# EAGLE design tick-ref-gps-main (EAGLE 6.2)
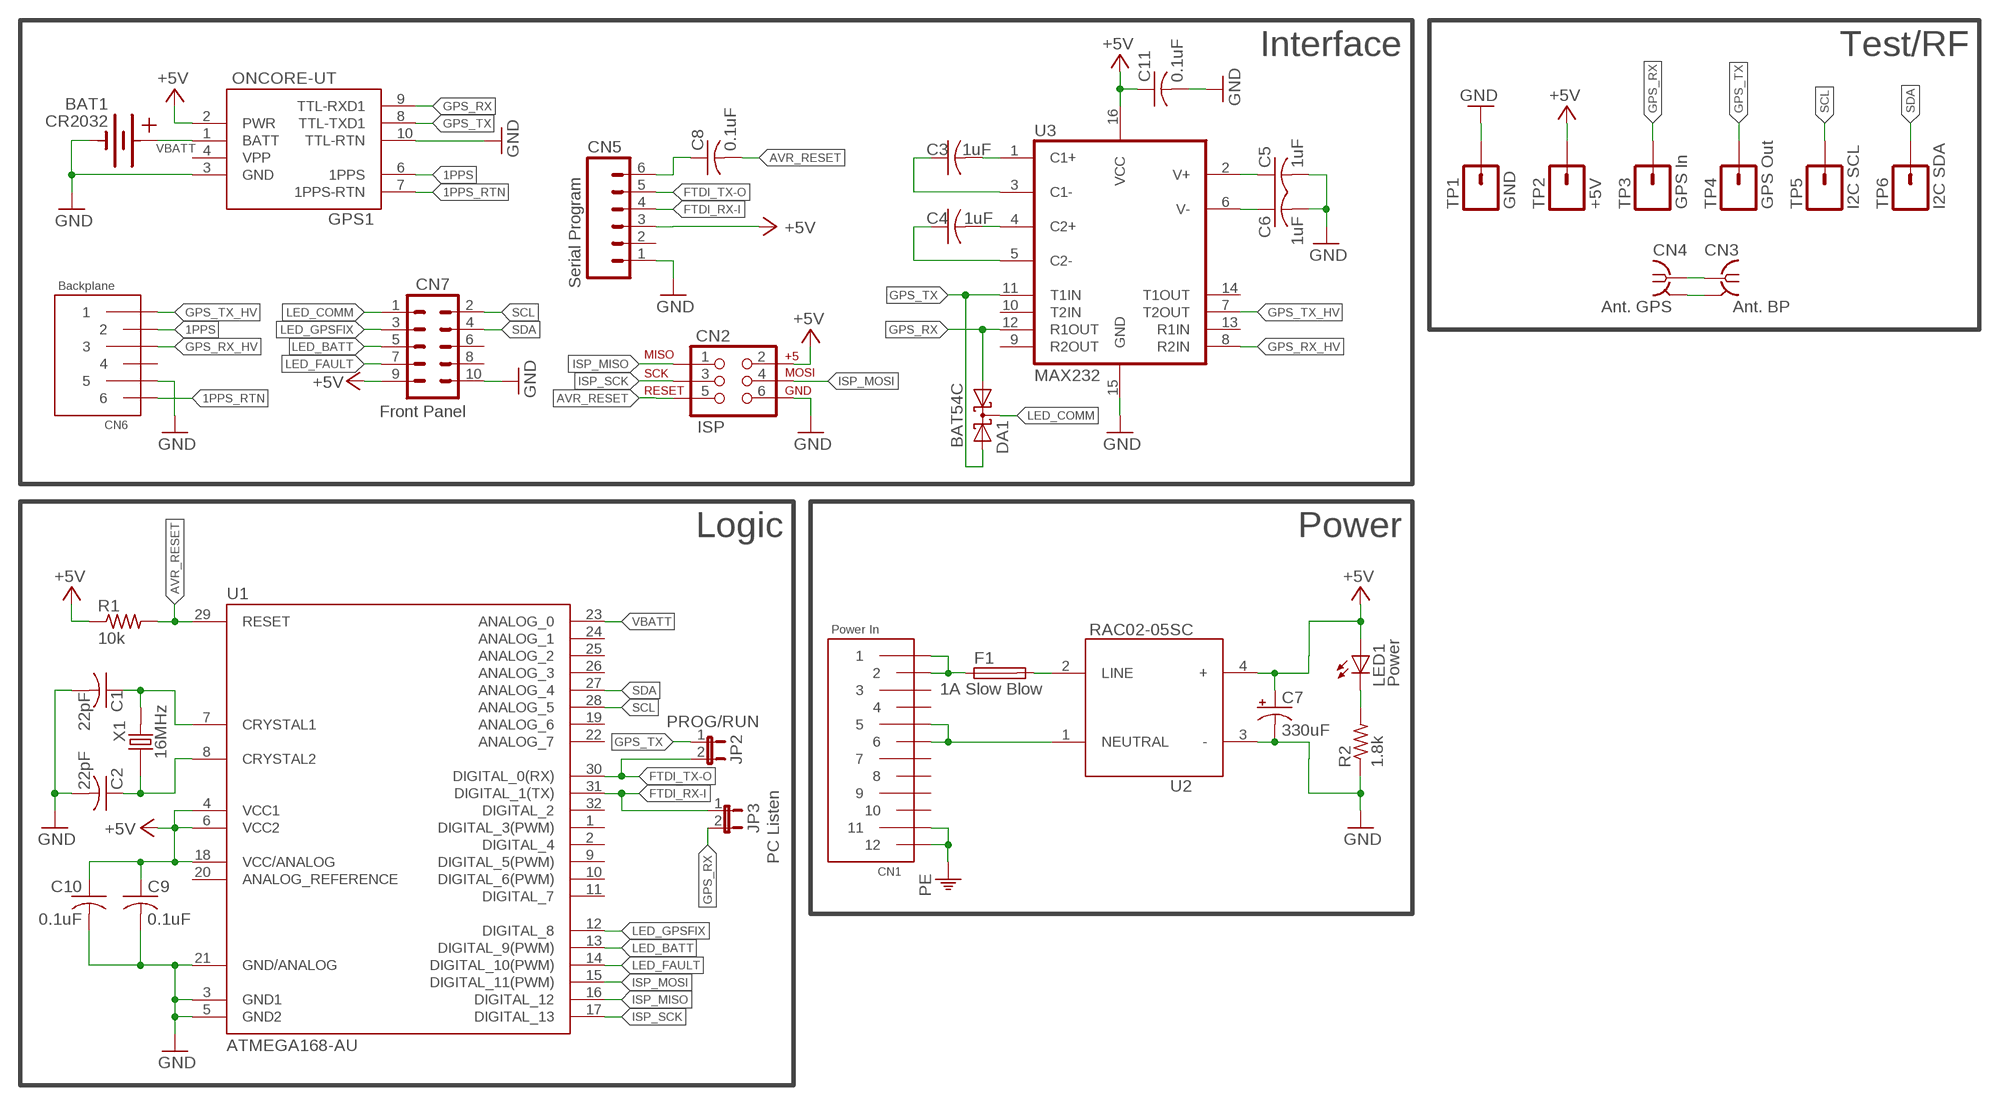
[diagram p0: schematic, sheet 1]

## Parts
BAT1  CR2032  [BK-912-CR2032]
C1  22pF  C-USC0603  [C0603]
C2  22pF  C-USC0603  [C0603]
C3  1uF  C-USC0603  [C0603]
C4  1uF  C-USC0603  [C0603]
C5  1uF  C-USC0603  [C0603]
C6  1uF  C-USC0603  [C0603]
C7  330uF  CPOL-USE5-10.5  [E5-10,5]
C8  0.1uF  C-USC0603  [C0603]
C9  0.1uF  C-USC0603  [C0603]
C10  0.1uF  C-USC0603  [C0603]
C11  0.1uF  C-USC0603  [C0603]
CN1  Power In  EDGECON-M-0.15-12  [EDGECON-M-0.15-12]
CN2  ISP  AVR_SPI_PRG_62X3_LOCK  [2X3_LOCK]
CN3  Ant. BP  COAX  [MMCX-J-P-X-ST-EM1-MKT]
CN4  Ant. GPS  MOLEX-MCX-V  [MOLEX-MCX-V]
CN5  Serial Program  M06LOCK  [1X06_LOCK]
CN6  Backplane  EDGECON-M-0.1-6  [EDGECON-M-0.1-6]
CN7  Front Panel  M05X2PTH  [AVR_ICSP]
DA1  BAT54C  [SOT23]
F1  1A Slow Blow  SH22,5A  [SH22,5A]
GPS1  ONCORE-UT  [ONCORE-UT]
JP2  PROG/RUN  JUMPER-2PTH_LOCK  [1X02_LOCK]
JP3  PC Listen  JUMPER-2SMD-NO  [SJ_2S-NO]
LED1  Power  LEDCHIP-LED0603  [CHIP-LED0603]
R1  10k  R-US_R0603  [R0603]
R2  1.8k  R-US_R0603  [R0603]
TP1  GND  M01PTH  [1X01]
TP2  +5V  M01PTH  [1X01]
TP3  GPS In  M01PTH  [1X01]
TP4  GPS Out  M01PTH  [1X01]
TP5  I2C SCL  M01PTH  [1X01]
TP6  I2C SDA  M01PTH  [1X01]
U1  ATMEGA168-AU  [TQFP32-08]
U2  RAC02-05SC  RAC0X-SC  [RAC0X-SC]
U3  MAX232  MAX232SOIC16  [SO016]
X1  16MHz  NX5032GA  [NX5032GA]

## Nets
1PPS: CN6.2 GPS1.6(1PPS)
1PPS_RTN: CN6.6 GPS1.7(1PPS-RTN)
+5V: C7.+ C9.1 C10.1 C11.1 CN2.2 CN5.3 CN7.9 GPS1.2(PWR) LED1.A R1.1 TP2.1 U1.4(VCC1) U1.6(VCC2) U1.18(VCC/ANALOG) U2.4(+) U3.16(VCC)
ANTENNA-GND: CN3.2@1(GND) CN4.GND1(GND) CN4.GND2(GND) CN4.GND3(GND) CN4.GND4(GND)
ANTENNA-RF: CN3.1 CN4.CTR(A)
AVR_RESET: C8.2 CN2.5 R1.2 U1.29(RESET)
FTDI_RTS: C8.1 CN5.6
FTDI_RX-I: CN5.4 JP3.1 U1.31(DIGITAL_1(TX))
FTDI_TX-O: CN5.5 JP2.2 U1.30(DIGITAL_0(RX))
GND: BAT1.-(-1) C1.2 C2.2 C5.2 C6.2 C7.- C9.2 C10.2 C11.2 CN2.6 CN5.1 CN6.5 CN7.10 GPS1.3(GND) GPS1.10(TTL-RTN) R2.1 TP1.1 U1.3(GND1) U1.5(GND2) U1.21(GND/ANALOG) U2.3(-) U3.15(GND)
GPS_RX: DA1.1(A1) GPS1.9(TTL-RXD1) JP3.2 TP3.1 U3.12(R1OUT)
GPS_RX_HV: CN6.3 U3.8(R2IN)
GPS_TX: DA1.2(A2) GPS1.8(TTL-TXD1) JP2.1 TP4.1 U3.11(T1IN)
GPS_TX_HV: CN6.1 U3.7(T2OUT)
ISP_MISO: CN2.1 U1.16(DIGITAL_12)
ISP_MOSI: CN2.4 U1.15(DIGITAL_11(PWM))
ISP_SCK: CN2.3 U1.17(DIGITAL_13)
LED1_R: LED1.C R2.2
LED_BATT: CN7.5 U1.13(DIGITAL_9(PWM))
LED_COMM: CN7.1 DA1.3(CC)
LED_FAULT: CN7.7 U1.14(DIGITAL_10(PWM))
LED_GPSFIX: CN7.3 U1.12(DIGITAL_8)
LINE: F1.2 U2.2(LINE)
LINE-PREFUSE: CN1.1 CN1.2 F1.1
MAX232-C1+: C3.2 U3.1(C1+)
MAX232-C1-: C3.1 U3.3(C1-)
MAX232-C2+: C4.2 U3.4(C2+)
MAX232-C2-: C4.1 U3.5(C2-)
MAX232-V+: C5.1 U3.2(V+)
MAX232-V-: C6.1 U3.6(V-)
NEUTRAL: CN1.5 CN1.6 U2.1(NEUTRAL)
PE [PE]: CN1.11 CN1.12
SCL: CN7.2 TP5.1 U1.28(ANALOG_5)
SDA: CN7.4 TP6.1 U1.27(ANALOG_4)
VBATT: BAT1.+1(+2) GPS1.1(BATT) U1.23(ANALOG_0)
XTAL1: C1.1 U1.7(CRYSTAL1) X1.P$2
XTAL2: C2.1 U1.8(CRYSTAL2) X1.P$1
Unconnected: CN1.3 CN1.4 CN1.7 CN1.8 CN1.9 CN1.10 CN5.2 CN6.4 CN7.6 CN7.8 GPS1.MOUNT1(MOUNTHOLE1) GPS1.MOUNT2(MOUNTHOLE2) GPS1.MOUNT3(MOUNTHOLE3) GPS1.MOUNT4(MOUNTHOLE4) U1.1(DIGITAL_3(PWM)) U1.2(DIGITAL_4) U1.9(DIGITAL_5(PWM)) U1.10(DIGITAL_6(PWM)) U1.11(DIGITAL_7) U1.19(ANALOG_6) U1.20(ANALOG_REFERENCE) U1.22(ANALOG_7) U1.24(ANALOG_1) U1.25(ANALOG_2) U1.26(ANALOG_3) U1.32(DIGITAL_2) U3.9(R2OUT) U3.10(T2IN) U3.13(R1IN) U3.14(T1OUT)

## Notes on the sheet
- Interface | Test/RF
- Logic | Power

## Power pins joined to a net without a drawn wire
GND: CN3.2@2(GND) CN3.2@3(GND) CN3.2@4(GND)
VPP: GPS1.4(VPP)

## Library data of the parts
BAT1 = con-sen:CR2032
C1-C6 C8-C11 = rcl:C-US: CAPACITOR, American symbol
C7 = rcl:CPOL-US: POLARIZED CAPACITOR, American symbol
CN1 = con-sen:EDGECON-M-0.15-12: 12 circuit 0.15" male edge connector fingers
CN2 = SparkFun:AVR_SPI_PRG_6: AVR ISP 6 Pin This is the reduced ISP connector for AVR programming. Common on Arduino. This footprint will take up less PCB space and can be used with a 10-pin to 6-pin adapter such as SKU: BOB-08508
CN3 = con-samtec:COAX: MMCX STRAIGHT, EDGE MOUNT JACK- 50 OHM Source: http://www.samtec.com/ftppub/cpdf/MMCX-J-P-X-ST-EM1-MKT.pdf; OC_FARNELL: unknown; OC_NEWARK: unknown
CN4 = con-sen:MOLEX-MCX-V: Molex 0733660061 vertical through hole PCB-mount MCX/OCX connector
CN5 = SparkFun:M06: Header 6 Standard 6-pin 0.1" header. Use with straight break away headers (SKU : PRT-00116), right angle break away headers (PRT-00553), swiss pins (PRT-00743), machine pins (PRT-00117), and female headers (PRT-00115). Molex polarized connector foot print use with SKU : PRT-08094 with associated crimp pins and housings. NOTES ON THE VARIANTS LOCK and LOCK_LONGPADS... This footprint was designed to help hold the alignment of a through-hole component (i.e. 6-pin header) while soldering it into place. You may notice that each hole has been shifted either up or down by 0.005 of an inch from it's more standard position (which is a perfectly straight line). This slight alteration caused the pins (the squares in the middle) to touch the edges of the holes. Because they are alternating, it causes a "brace" to hold the component in place. 0.005 has proven to be the perfect amount of "off-center" position when using our standard breakaway headers. Although looks a little odd when you look at the bare footprint, once you have a header in there, the alteration is very hard to notice. Also, if you push a header all the way into place, it is covered up entirely on the bottom side. This idea of altering the position of holes to aid alignment will be further integrated into the Sparkfun Library for other footprints. It can help hold any component with 3 or more connection pins.
CN6 = con-sen:EDGECON-M-0.1-6: 6 circuit 0.1" male edge connector fingers
CN7 = SparkFun-Connectors:M05X2: Header 5x2 Standard 10-pin dual row 0.1" header. Commonly used with AVR-ISP. Use with Spark Fun Electronics SKU: PRT-00778
DA1 = diode:BAT54C: Schottky Diodes Source: Fairchild .. BAT54.pdf
F1 = fuse:SH22,5A: FUSE HOLDER grid 22,5mm, isolated cap OGN0031 8201, Schurter (Buerklin); MPN: 0031.7701.11; OC_FARNELL: unknown; OC_NEWARK: 04F1224
GPS1 = motorola-sen:ONCORE-UT: Motorola OnCore UT timing GPS receiver
JP2 JP3 = SparkFun:JUMPER-2: Jumper Basic 0.1" spaced jumper. Use with breakaway headers.
LED1 = led:LED: LED OSRAM: - CHIPLED LG R971, LG N971, LY N971, LG Q971, LY Q971, LO R971, LY R971 LH N974, LH R974 LS Q976, LO Q976, LY Q976 LO Q996 - Hyper CHIPLED LW Q18S LB Q993, LB Q99A, LB R99A - SideLED LS A670, LO A670, LY A670, LG A670, LP A670 LB A673, LV A673, LT A673, LW A673 LH A674 LY A675 LS A676, LA A676, LO A676, LY A676, LW A676 LS A679, LY A679, LG A679 - Hyper Micro SIDELED® LS Y876, LA Y876, LO Y876, LY Y876 LT Y87S - SmartLED LW L88C, LW L88S LB L89C, LB L89S, LG L890 LS L89K, LO L89K, LY L89K LS L896, LA L896, LO L896, LY L896 - TOPLED LS T670, LO T670, LY T670, LG T670, LP T670 LSG T670, LSP T670, LSY T670, LOP T670, LYG T670 LG T671, LOG T671, LSG T671 LB T673, LV T673, LT T673, LW T673 LH T674 LS T676, LA T676, LO T676, LY T676, LB T676, LH T676, LSB T676, LW T676 LB T67C, LV T67C, LT T67C, LS T67K, LO T67K, LY T67K, LW E67C LS E67B, LA E67B, LO E67B, LY E67B, LB E67C, LV E67C, LT E67C LW T67C LS T679, LY T679, LG T679 LS T770, LO T770, LY T770, LG T770, LP T770 LB T773, LV T773, LT T773, LW T773 LH T774 LS E675, LA E675, LY E675, LS T675 LS T776, LA T776, LO T776, LY T776, LB T776 LHGB T686 LT T68C, LB T68C - Hyper Mini TOPLED® LB M676 - Mini TOPLED Santana® LG M470 LS M47K, LO M47K, LY M47K Source: http://www.osram.convergy.de LUXEON: - LUMILED® LXK2-PW12-R00, LXK2-PW12-S00, LXK2-PW14-U00, LXK2-PW14-V00 LXK2-PM12-R00, LXK2-PM12-S00, LXK2-PM14-U00 LXK2-PE12-Q00, LXK2-PE12-R00, LXK2-PE12-S00, LXK2-PE14-T00, LXK2-PE14-U00 LXK2-PB12-K00, LXK2-PB12-L00, LXK2-PB12-M00, LXK2-PB14-N00, LXK2-PB14-P00, LXK2-PB14-Q00 LXK2-PR12-L00, LXK2-PR12-M00, LXK2-PR14-Q00, LXK2-PR14-R00 LXK2-PD12-Q00, LXK2-PD12-R00, LXK2-PD12-S00 LXK2-PH12-R00, LXK2-PH12-S00 LXK2-PL12-P00, LXK2-PL12-Q00, LXK2-PL12-R00 Source: www.luxeon.com KINGBRIGHT: KA-3528ASYC Source: www.kingbright.com
R1 R2 = rcl:R-US_: RESISTOR, American symbol
TP1-TP6 = SparkFun:M01: Header 1 Standard 1-pin 0.1" header. Use with straight break away headers (SKU : PRT-00116), right angle break away headers (PRT-00553), swiss pins (PRT-00743), machine pins (PRT-00117), and female headers (PRT-00115).
U1 = Arduino-AVR:ATMEGA168
U2 = recom-sen:RAC0X-SC: Racom RAC01-SC/RAC02-SC series AC/DC converters
U3 = SparkFun-DigitalIC:MAX232: RS232 Transceiver Very common IC. This is generically called 'MAX232', but works with the 3V equivalent MAX3232 generic ICs. Field tested and mother approved. Spark Fun Electronics SKU : COM-00316 (DIP) and COM-00589 (SMD)
X1 = crystal-sen:NX5032GA

## Net classes
1 PE: width 1.016 mm, clearance 0.508 mm

## Board
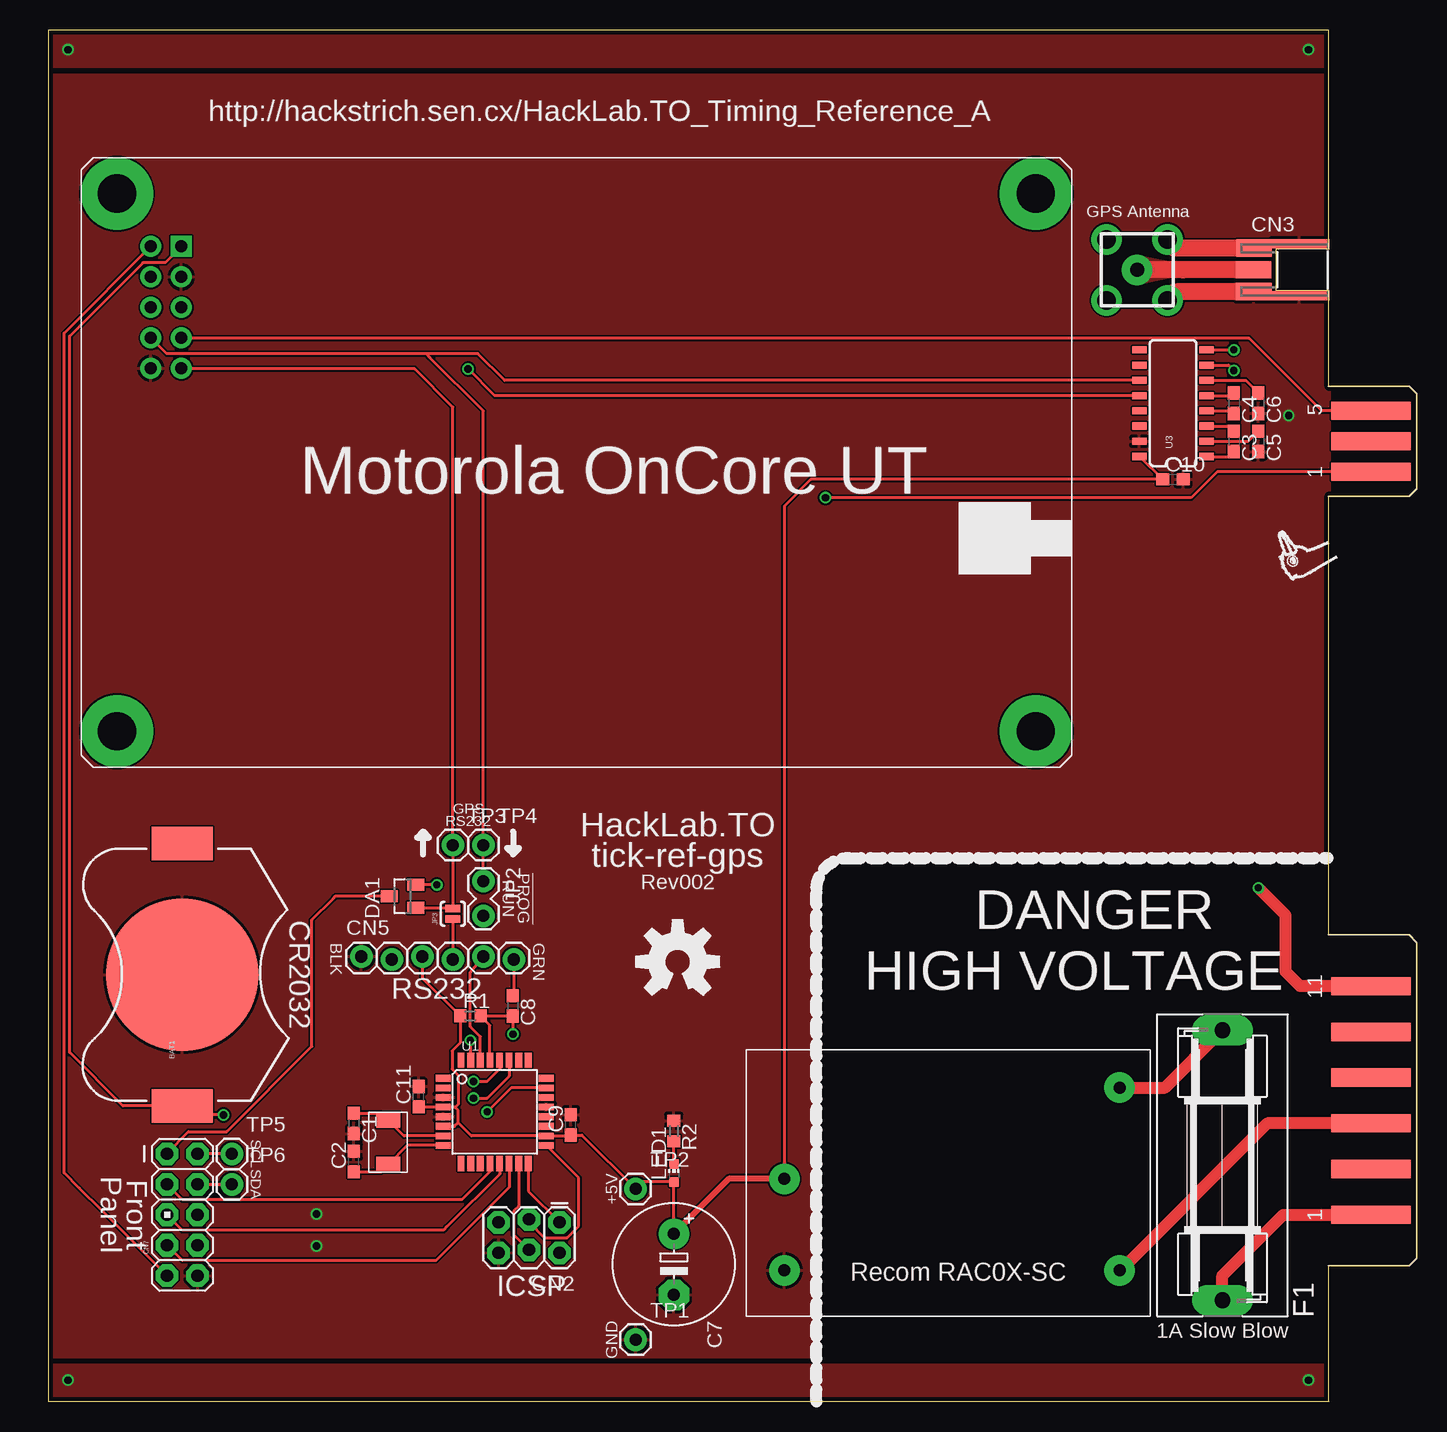
[diagram p1: board, top side]
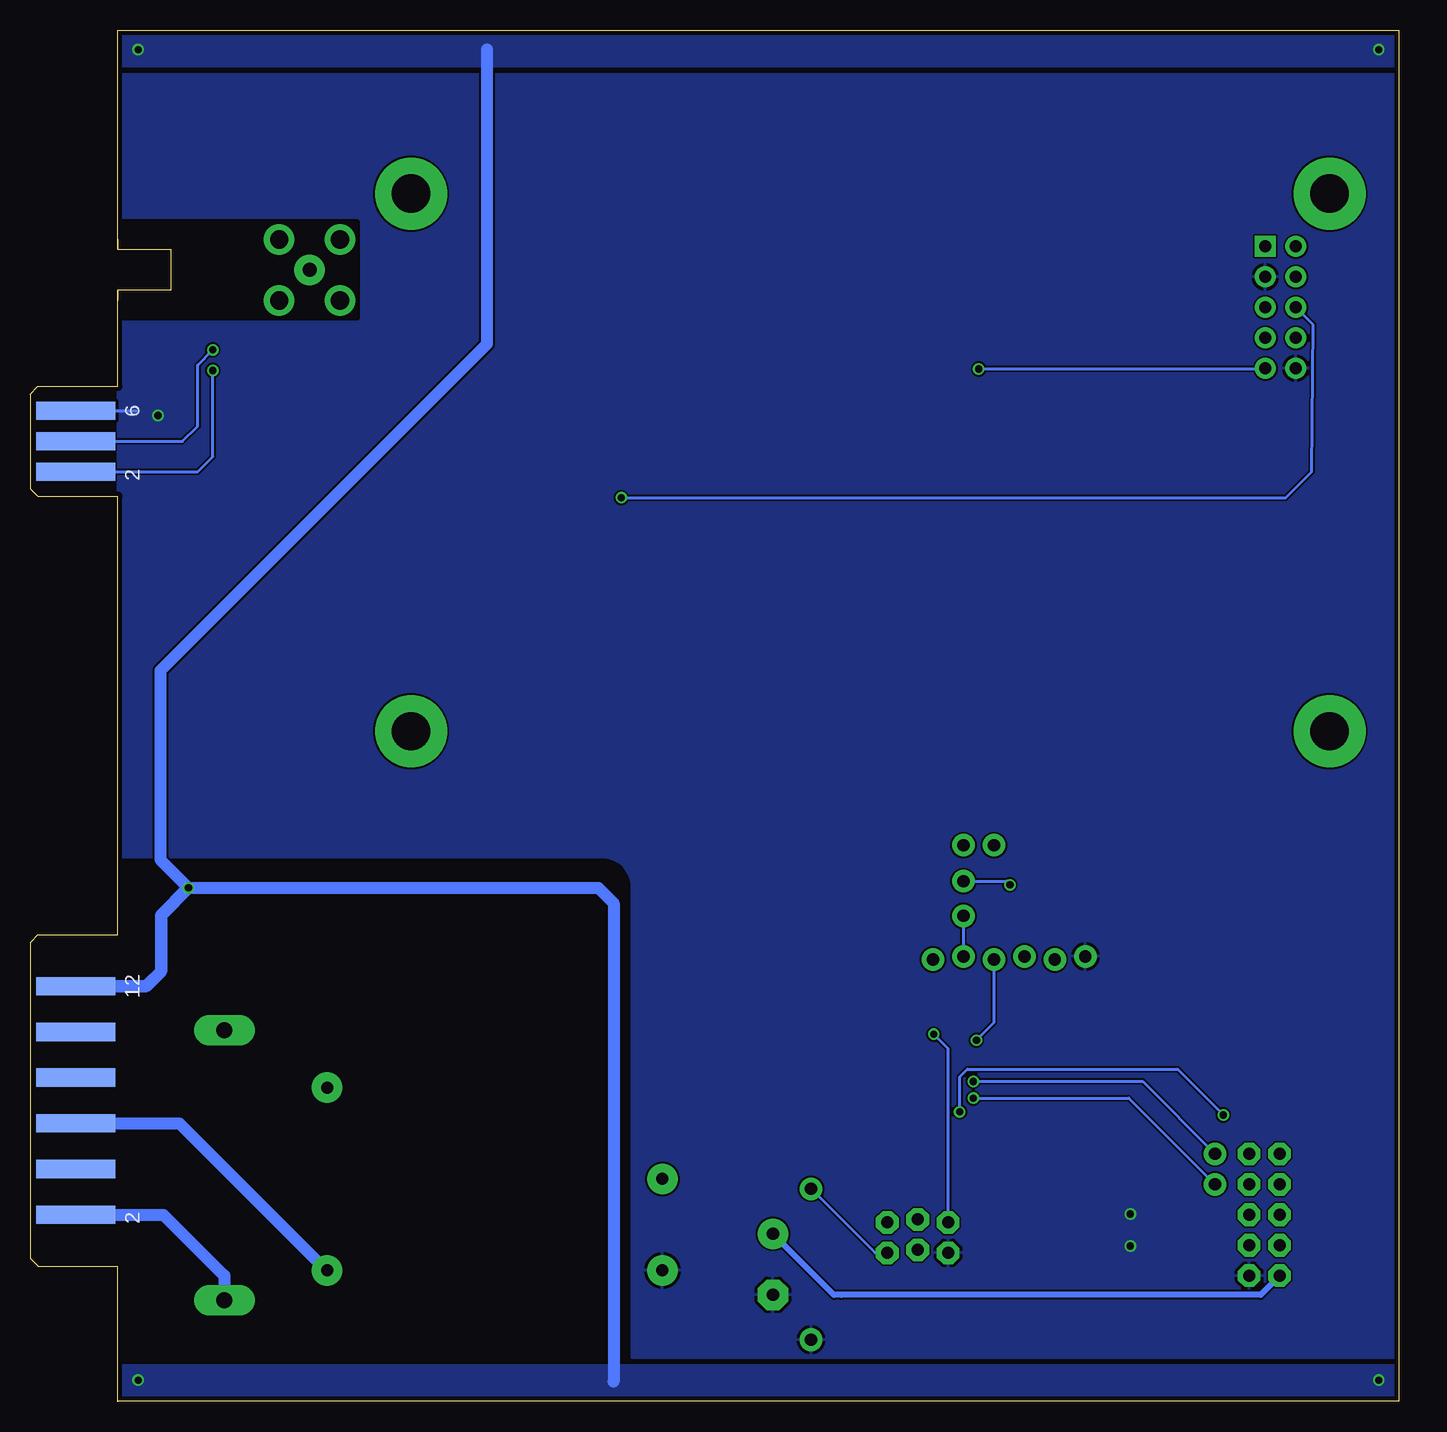
[diagram p2: board, bottom side, seen from below]

Size 114.05 x 114.3 mm. Coordinates in mm from the lower left corner, seen from the top.
Outline: 106.72,75.45 106.72,38.89 113.41,38.89
Outline: 106.72,75.45 106.72,75.44
Outline: 106.72,92.6 106.72,84.61 113.4,84.61
Outline: 106.72,96.02 106.72,114.3 0,114.3 0,0.01 106.72,0.01 106.72,0 106.72,11.3 113.4,11.3
Outline: 114.05,83.96 113.4,84.61
Outline: 114.05,83.96 114.05,76.09
Outline: 114.05,76.09 113.41,75.45
Outline: 113.41,75.45 113.41,75.45
Outline: 113.41,75.45 106.72,75.45
Outline: 114.05,11.95 113.41,11.32
Outline: 113.41,38.89 114.05,38.25
Outline: 114.05,38.25 114.05,11.95
Copper layers (1*16): Top 0.0356mm / dielectric 1.5011mm / Bottom 0.0356mm
Design rules: minimum track width 6mil, minimum drill 13mil, track to track 6mil, track to pad 6mil, pad to pad 6mil, via to via 6mil, smd to smd 6mil, copper to edge 15mil, drill to drill 6mil, minimum pad ring 7mil, minimum via ring 7mil, stop-mask expansion 4mil, vias tented up to drill 0mil, thermal gap 10mil
tRestrict: area 89.5,96.3 to 91.9,97.5; area 87.6,93.1 to 88.9,95.5; area 89.5,91.1 to 91.9,92.3
bRestrict: area 86.7,90.3 to 106.3,98.3

### Footprints (pad centres in the part's own frame; a part is rotated, then mirrored left to right if it is on the bottom)
BK-912-CR2032 = smd 2.794 x 5.08: +1 -10.922,0; +2 10.922,0 | smd 12.7 x 12.7: - 0,0
C0603 = smd 1.1 x 1: 1 -0.85,0; 2 0.85,0
E5-10,5 = drill 1.016 pad 2.54: + -2.54,0 | drill 1.016 pad 2.54 octagon: - 2.54,0
EDGECON-M-0.15-12 = smd 1.524 x 6.604 bottom: 1 -9.525,0; 3 -5.715,0; 5 -1.905,0; 7 1.905,0; 9 5.715,0; 11 9.525,0 | smd 1.524 x 6.604: 2 -9.525,0; 4 -5.715,0; 6 -1.905,0; 8 1.905,0; 10 5.715,0; 12 9.525,0
2X3_LOCK = drill 1.016 pad 1.88 octagon: 1 0,0; 2 0,2.54; 3 2.54,-0.254; 4 2.54,2.286; 5 5.08,0; 6 5.08,2.54
MMCX-J-P-X-ST-EM1-MKT = smd 1.4 x 2.975: 1 0,-6.15 | smd 1.46 x 2.975: 2@1 -1.812,-6.125; 2@2 1.812,-6.138 | smd 0.76 x 4.7: 2@3 -2.163,-2.35; 2@4 2.163,-2.35
MOLEX-MCX-V = drill 1.168 pad 2.54: CTR 0,0 | drill 1.524 pad 2.54: GND1 -2.54,2.54; GND2 2.54,2.54; GND3 2.54,-2.54; GND4 -2.54,-2.54
1X06_LOCK = drill 1.016 pad 1.88: 1 0,0; 2 2.54,-0.254; 3 5.08,0; 4 7.62,-0.254; 5 10.16,0; 6 12.7,-0.254
EDGECON-M-0.1-6 = smd 1.524 x 6.604 bottom: 1 -2.54,0; 3 0,0; 5 2.54,0 | smd 1.524 x 6.604: 2 -2.54,0; 4 0,0; 6 2.54,0
AVR_ICSP = drill 1.016 pad 1.88 octagon: 1 -1.27,5.08; 2 1.27,5.08; 3 -1.27,2.54; 4 1.27,2.54; 5 -1.27,0; 6 1.27,0; 7 -1.27,-2.54; 8 1.27,-2.54; 9 -1.27,-5.08; 10 1.27,-5.08
SOT23 = smd 1 x 1.4: 1 -0.95,-1.1; 2 0.95,-1.1; 3 0,1.1
SH22,5A = drill 1.321 pad 2.54 long: 1 -11.252,0; 2 11.252,0
ONCORE-UT = drill 1 pad 1.75 square: 1 71.2,4.4 | drill 1 pad 1.75: 2 73.74,4.4; 3 71.2,6.94; 4 73.74,6.94; 5 71.2,9.48; 6 73.74,9.48; 7 71.2,12.02; 8 73.74,12.02; 9 71.2,14.56; 10 73.74,14.56 | drill 3.2 pad 6: MOUNT1 0,0; MOUNT2 76.55,0; MOUNT3 0,44.8; MOUNT4 76.55,44.8
1X02_LOCK = drill 1.016 pad 1.88: 1 -0.178,0; 2 2.718,0
SJ_2S-NO = smd 0.635 x 1.27: 1 -0.45,0; 2 0.45,0
CHIP-LED0603 = smd 0.8 x 0.8: A 0,-0.75; C 0,0.75
R0603 = smd 1 x 1.1: 1 -0.85,0; 2 0.85,0
1X01 = drill 1.016 pad 1.88: 1 0,0
TQFP32-08 = smd 1.27 x 0.559: 1 -4.293,2.8; 2 -4.293,2; 3 -4.293,1.2; 4 -4.293,0.4; 5 -4.293,-0.4; 6 -4.293,-1.2; 7 -4.293,-2; 8 -4.293,-2.8; 17 4.293,-2.8; 18 4.293,-2; 19 4.293,-1.2; 20 4.293,-0.4; 21 4.293,0.4; 22 4.293,1.2; 23 4.293,2; 24 4.293,2.8 | smd 0.559 x 1.27: 9 -2.8,-4.293; 10 -2,-4.293; 11 -1.2,-4.293; 12 -0.4,-4.293; 13 0.4,-4.293; 14 1.2,-4.293; 15 2,-4.293; 16 2.8,-4.293; 25 2.8,4.293; 26 2,4.293; 27 1.2,4.293; 28 0.4,4.293; 29 -0.4,4.293; 30 -1.2,4.293; 31 -2,4.293; 32 -2.8,4.293
RAC0X-SC = drill 1 pad 2.54: 1 -15.24,6.35; 2 -15.24,-8.89; 3 12.7,6.35; 4 12.7,-1.27
SO016 = smd 0.6 x 1.2: 1 -4.445,-2.8; 2 -3.175,-2.8; 3 -1.905,-2.8; 4 -0.635,-2.8; 5 0.635,-2.8; 6 1.905,-2.8; 7 3.175,-2.8; 8 4.445,-2.8; 9 4.445,2.8; 10 3.175,2.8; 11 1.905,2.8; 12 0.635,2.8; 13 -0.635,2.8; 14 -1.905,2.8; 15 -3.175,2.8; 16 -4.445,2.8
NX5032GA = smd 1.3 x 2: P$1 -1.85,0; P$2 1.85,0

### Placement (x,y rotation side)
BAT1  11.18,35.57 90 top
C1  25.46,23.19 270 top
C2  25.46,20.02 90 top
C3  98.81,80.02 270 top
C4  98.81,83.2 270 top
C5  100.85,80.02 270 top
C6  100.85,83.2 270 top
C7  52.13,11.44 270 top
C8  38.7,32.98 270 top
C9  43.56,23.06 90 top
C10  93.73,76.85 0 top
C11  30.86,25.41 90 top
CN1  110.24,25.1 90 top
CN2  42.61,14.94 180 top
CN3  106.6,94.31 270 top
CN4  90.74,94.31 0 top
CN5  26.1,37.1 0 top
CN6  110.24,80.02 90 top
CN7  11.18,15.57 0 top
DA1  29.53,42.11 90 top
F1  97.85,19.7 90 top
GPS1  82.3,100.66 180 top
JP2  36.26,43.19 270 top
JP3  33.72,40.65 90 top
LED1  52.13,19.06 0 top
R1  35.18,32.14 0 top
R2  52.13,22.56 270 top
TP1  48.96,5.16 0 top
TP2  48.96,17.73 0 top
TP3  33.72,46.37 0 top
TP4  36.26,46.37 0 top
TP5  15.3,20.65 0 top
TP6  15.3,18.11 0 top
U1  37.21,24.14 0 top
U2  74.04,17.28 180 top
U3  93.73,83.2 90 top
U$1  [OSHW-LOGO-L]  52.45,36.65 0 top
U$2  [STRICH-LOGO-R]  105.28,69.96 120 top
X1  28.32,21.6 90 top

### Tracks (layer width: path | path; a pad name or v marks a point on that pad's centre or on a via)
1PPS  (via drill 0.6)
  Top 0.254: CN6.2 97.41,77.48 95.25,75.32 v64.77,75.32
  Bottom 0.254: v64.77,75.32 9.4,75.32 7.24,77.48 7.11,89.74 GPS1.6
1PPS_RTN
  Top 0.254: CN6.6 106.11,82.56 100.08,88.59 11.69,88.59 11.14,88.59 GPS1.7
+5V
  Top 0.254: C7.+ LED1.A 49.54,18.31 TP2.1 44.47,22.21 C9.1 43.49,22.14 U1.18 35.27,22.14 34.16,23.25 | U3.16 90.97,78.75 C10.1 63.56,76.85 61.34,74.62 61.34,65.73 U2.4 | C11.1 32.9,24.56 U1.4 32.94,24.52 33.91,24.52 | CN5.3 31.18,35.29 R1.1 34.33,29.9 33.66,29.22 33.66,27.7 34.16,27.19 34.16,24.78 33.91,24.52 | CN7.9 4.51,15.89 2.6,17.79 1.33,19.06 1.33,89.04 GPS1.2 | U1.6 33.85,22.94 34.16,23.25 | 34.16,23.25 34.16,24.27 33.91,24.52
  Top 0.508: U2.4 56.71,18.55 C7.+
  Bottom 0.254: CN2.2 43.62,12.4 TP2.1
  Bottom 0.508: CN7.9 11.49,8.9 46.42,8.9 47.05,8.9 C7.+
ANTENNA-GND
  Top 1.016: CN4.GND3 93.28,91.71
  Top 1.422: CN3.2@1 94.01,96.12 arc-90 CN4.GND2 | 100.46,92.47 94.04,92.47 arc90 93.28,91.71
ANTENNA-RF
  Top 1.422: CN3.1 94.55,94.31 CN4.CTR
  pour Top (no thermals): 90.81,95.38 93.6,94.82 93.6,93.81 90.78,93.24
AVR_RESET  (via drill 0.6)
  Top 0.254: U1.29 36.81,31.36 R1.2 36.05,32.12 38.68,32.12 C8.2 38.73,32.09 v38.73,30.62
  Bottom 0.254: CN2.5 37.53,29.41 v38.73,30.62
FTDI_RTS
  Top 0.254: CN5.6 38.8,33.93 C8.1
FTDI_RX-I  (via drill 0.6)
  Top 0.254: JP3.1 CN5.4 | v35.18,30.11 35.18,28.47 U1.31
  Bottom 0.254: CN5.4 33.72,31.57 v35.18,30.11
FTDI_TX-O
  Top 0.254: U1.30 36.01,30.42 35.18,31.25 35.18,35.76 CN5.5
  Bottom 0.254: JP2.2 CN5.5
GND  (via drill 0.6)
  Top 0.254: CN3.2@4 100.64,92.15 arc-90 CN3.2@2
  Bottom 0.254: CN6.5 105.16,82.56
  other vias: 22.35,12.97 22.35,15.63 103.38,82.18
  pour Bottom: 0,3.7 0,110.57 106.74,110.57 106.74,45.42 66.42,45.42 arc90 63.88,42.88 63.88,3.7
  pour Top: 0,3.7 0,110.57 106.74,110.57 106.74,45.42 66.42,45.42 arc90 63.88,42.88 63.88,3.7
GPS_RX  (via drill 0.6)
  Top 0.254: GPS1.9 11.14,86.06 30.54,86.06 33.72,82.88 TP3.1 JP3.2 30.69,41.1 DA1.1 | U3.12 37.21,83.83 v34.99,86.06
  Bottom 0.254: v34.99,86.06 11.14,86.06 GPS1.9
GPS_RX_HV  (via drill 0.6)
  Top 0.254: U3.8 97.85,87.64 v98.81,87.64
  Bottom 0.254: CN6.3 101.35,80.02 100.08,81.29 100.08,86.37 v98.81,87.64
GPS_TX  (via drill 0.6)
  Top 0.254: JP2.1 TP4.1 36.26,82.56 31.81,87.01 31.5,87.32 31.18,87.32 | 31.18,87.32 9.87,87.32 GPS1.8 | U3.11 38.04,85.1 35.81,87.32 31.18,87.32 | v32.38,43.07 DA1.2
  Bottom 0.254: JP2.1 32.69,43.37 v32.38,43.07
GPS_TX_HV  (via drill 0.6)
  Top 0.254: U3.7 98.36,86.37 v98.81,85.93
  Bottom 0.254: CN6.1 100.08,77.48 98.81,78.75 v98.81,85.93
ISP_MISO
  Top 0.254: U1.16 40.01,17.53 CN2.1
ISP_MOSI
  Top 0.254: U1.15 39.21,16.3 38.8,15.89 38.8,13.92 CN2.4
ISP_SCK
  Top 0.254: CN2.3 40.07,14.93 41.34,13.66 43.24,13.66 44.2,14.62 44.2,18.65 U1.17
LED1_R
  Top 0.254: LED1.C R2.2
LED_BATT
  Top 0.254: U1.13 37.61,18.95 33.27,14.62 32.96,14.3 11.18,14.3 CN7.5
LED_COMM
  Top 0.254: CN7.1 9.91,20.71 11.68,22.49 14.86,22.49 21.97,29.6 21.97,40.14 23.75,41.92 | 23.75,41.92 23.88,42.05 | DA1.3 23.94,42.11 23.75,41.92
LED_FAULT
  Top 0.254: U1.14 38.41,17.85 32.32,11.76 13.14,11.76 11.18,11.76 CN7.7
LED_GPSFIX
  Top 0.254: U1.12 36.81,19.17 34.8,17.16 34.67,17.03 34.48,16.84 11.18,16.84 CN7.3
LINE
  Top 1.016: U2.2 93.08,26.17 F1.2
LINE-PREFUSE
  Top 1.016: F1.1 97.85,10.49 102.93,15.57 CN1.2
  Bottom 1.016: CN1.2 102.93,15.57 97.85,10.49 F1.1
MAX232-C1+
  Top 0.254: U3.1 98.39,78.75 C3.2
MAX232-C1-
  Top 0.254: U3.3 98.39,81.29 C3.1
MAX232-C2+
  Top 0.254: U3.4 98.59,82.56 C4.2
MAX232-C2-
  Top 0.254: U3.5 98.59,83.83 C4.1
MAX232-V+
  Top 0.254: U3.2 100,80.02 C5.1
MAX232-V-
  Top 0.254: U3.6 99.8,85.1 C6.1
NEUTRAL
  Top 1.016: CN1.6 101.6,23.19 89.28,10.87 U2.1
  Bottom 1.016: CN1.6 101.6,23.19 89.28,10.87 U2.1
PE  (via drill 0.6)
  Top 1.016: CN1.12 104.33,34.62 103.12,35.83 103.12,40.53 v100.84,42.81
  Bottom 1.016: 75.95,112.66 75.95,88.15 80.52,83.58 103.19,60.91 103.19,45.16 v100.84,42.81 | 65.41,1.66 65.41,41.54 66.67,42.81 100.58,42.81 v100.84,42.81 | 104.33,34.62 CN1.12 104.33,34.62 | v100.84,42.81 103.12,40.53 | 103.12,40.4 103.12,35.83 | 103.12,35.83 104.27,34.68 | 103.12,35.83 104.33,34.62 | 104.33,34.62 103.12,35.83 | 103.12,35.83 103.12,40.53 | 103.12,40.53 v100.84,42.81
  other vias: 105.03,112.66 1.65,112.66 1.65,1.79 105.03,1.79
  pour Bottom: 0,0.01 106.68,0.01 106.68,3.01 0,3.01
  pour Bottom: 0,111.26 106.81,111.26 106.81,114.26 0,114.26
  pour Top: 0,111.26 106.81,111.26 106.81,114.26 0,114.26
  pour Top: 0,0.01 106.68,0.01 106.68,3.01 0,3.01
SCL  (via drill 0.6)
  Top 0.254: TP5.1 CN7.2 | U1.28 37.61,27.72 36.58,26.68 v35.43,26.68
  Bottom 0.254: v35.43,26.68 21.34,26.68 TP5.1
SDA  (via drill 0.6)
  Top 0.254: CN7.4 TP6.1 | U1.27 38.41,27.12 36.58,25.29 v35.43,25.29
  Bottom 0.254: v35.43,25.29 22.48,25.29 TP6.1
VBATT  (via drill 0.6)
  Top 0.254: GPS1.1 9.78,94.95 7.94,94.95 7.87,94.88 1.78,88.79 1.78,34.49 1.78,29.1 6.22,24.65 BAT1.+1 11.94,23.89 v14.61,23.89 | U1.23 38.58,26.14 v36.58,24.14
  Bottom 0.254: v36.58,24.14 36.58,27.06 35.94,27.7 18.41,27.7 v14.61,23.89
XTAL1
  Top 0.254: U1.7 29.63,22.14 X1.P$2 27.73,24.04 C1.1
XTAL2
  Top 0.254: C2.1 27.73,19.16 X1.P$1 29.91,21.34 U1.8

### Text on the board
tPlace: http://hackstrich.sen.cx/HackLab.TO_Timing_Reference_A | GPS Antenna | GPS | RS232 | HackLab.TO | tick-ref-gps | Rev002 | RUN | !PROG | DANGER | BLK | GRN | CR2032 | RS232 | HIGH VOLTAGE | SCL | SDA | +5V | Panel | Front | ICSP | 1A Slow Blow | GND